# Altium project ctrl_board.PrjPCB
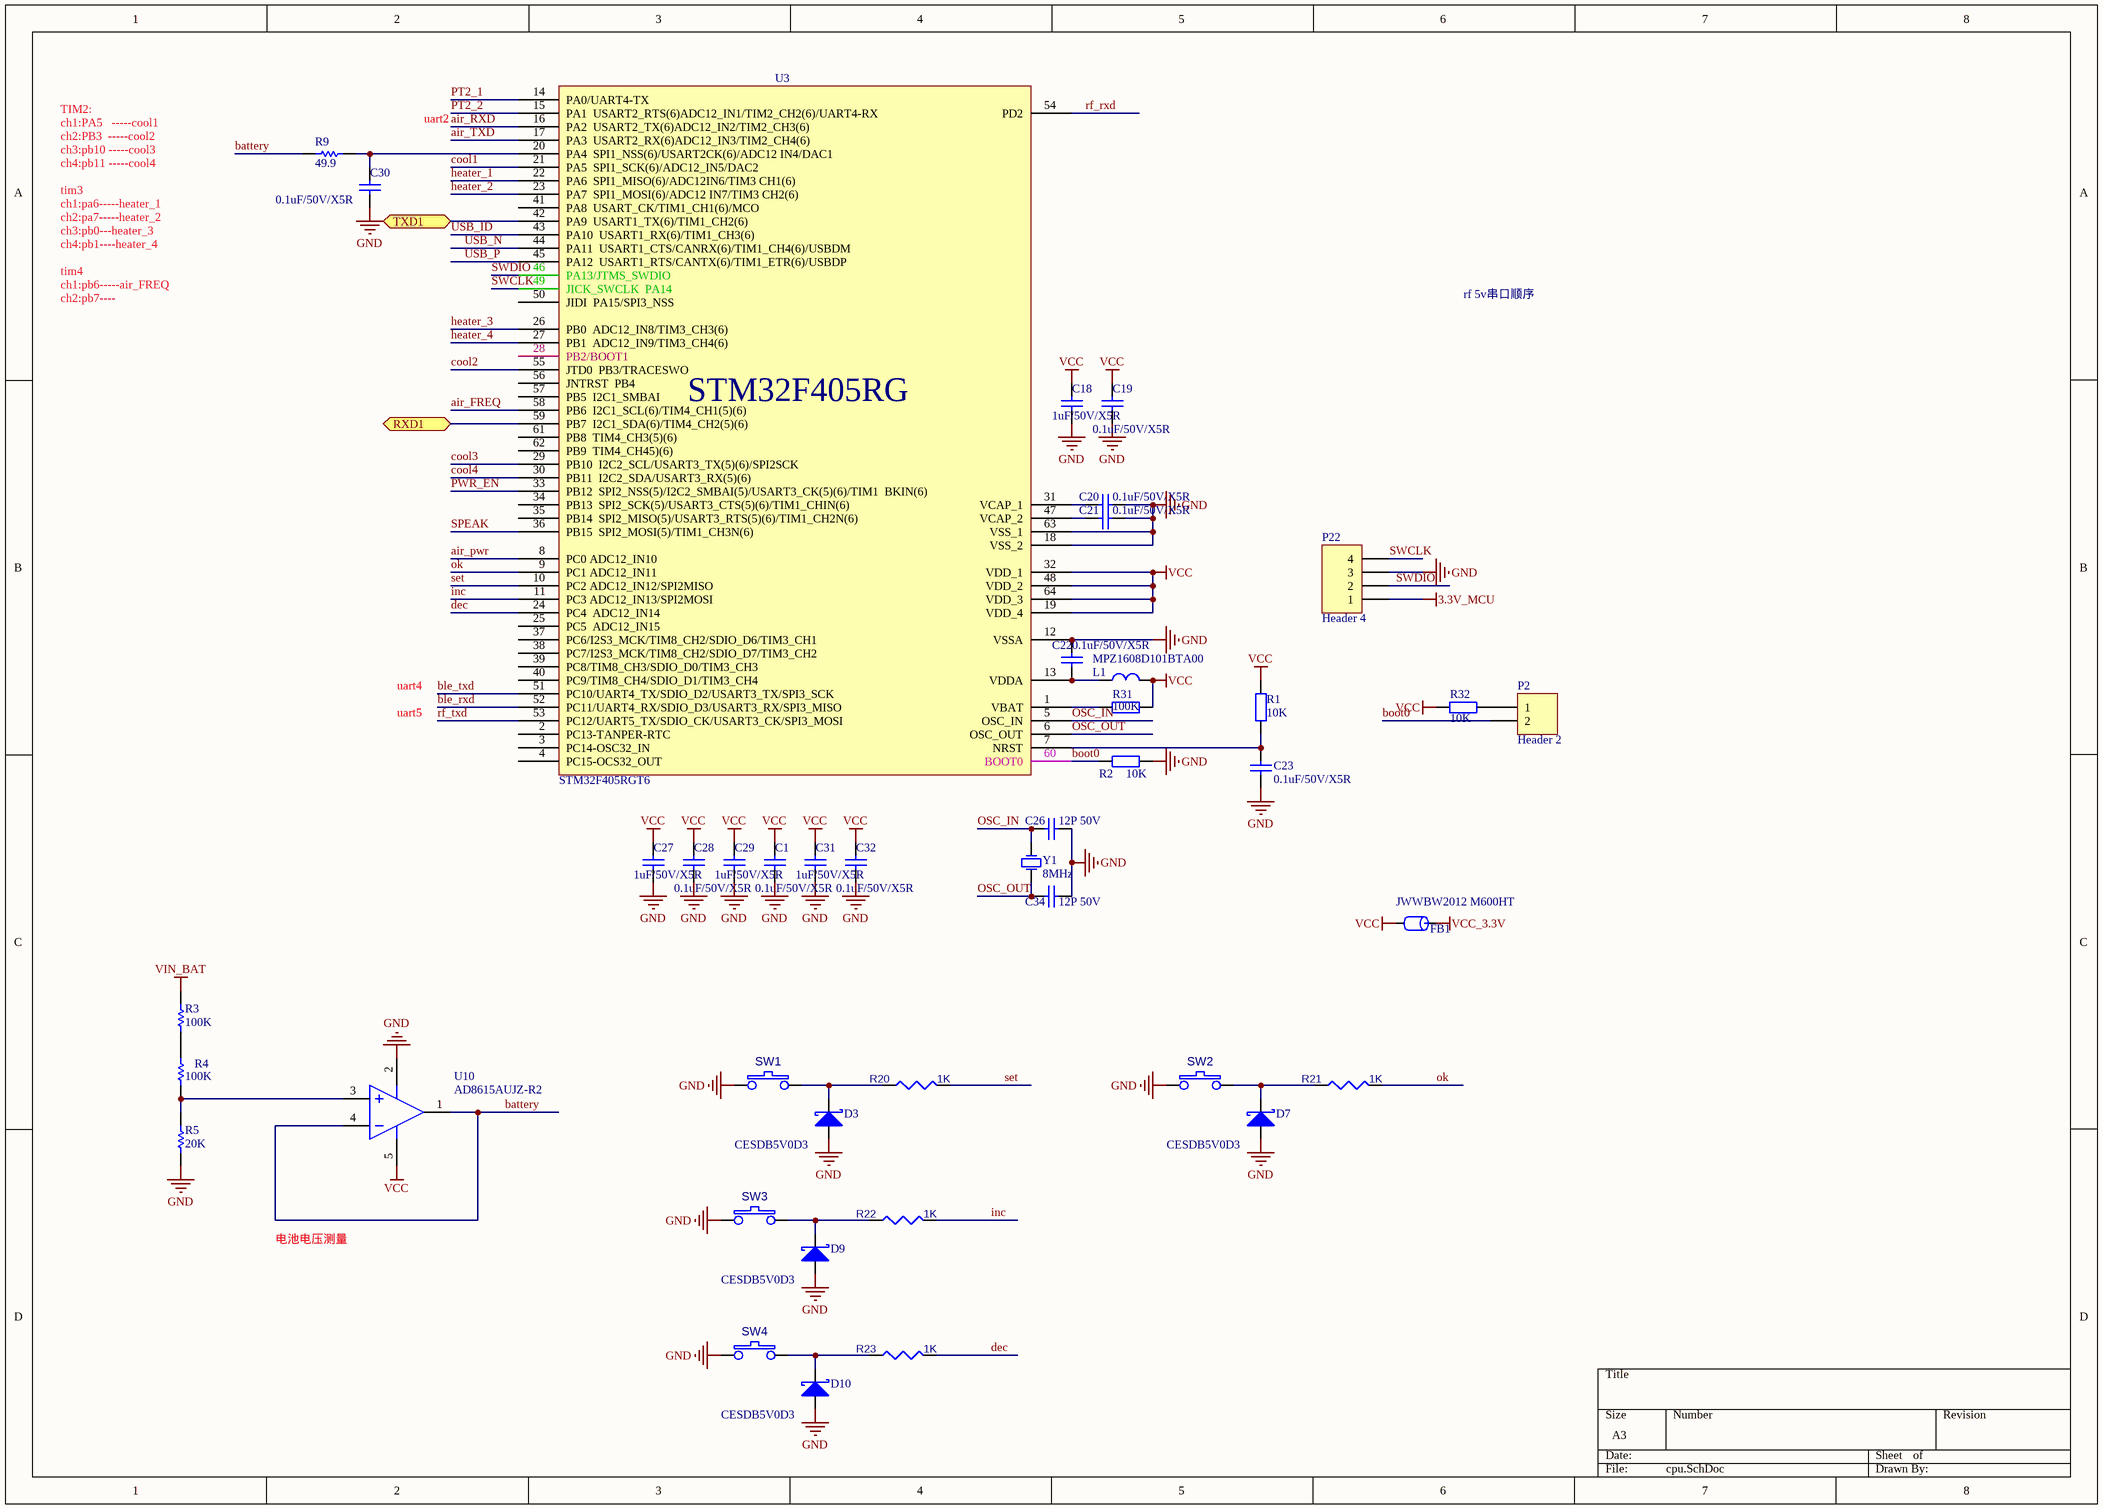
[diagram p0: cpu.SchDoc]
4 sheets, 105 parts. Net scope: global (net labels, ports and power ports of the same name join across sheets).
Board file: ctrl_boardV1.1.PcbDoc
Sheets:
  cpu.SchDoc
  connector.SchDoc
  power.SchDoc
  drv.SchDoc

## Sheet cpu.SchDoc
size A3

### Parts
(Parts that share a designator on the sheet are numbered #1, #2 ... from top to bottom, then left to right.)
C1  0.1uF/50V/X5R  [0603C]
C18  1uF/50V/X5R  [0603C]
C19  0.1uF/50V/X5R  [0603C]
C20  0.1uF/50V/X5R  [0603C]
C21  0.1uF/50V/X5R  [0603C]
C22  0.1uF/50V/X5R  [0603C]
C23  0.1uF/50V/X5R  [0603C]
C26#1  12P 50V  [0603C]
C27#1  1uF/50V/X5R  [0603C]
C28#1  0.1uF/50V/X5R  [0603C]
C29#1  1uF/50V/X5R  [0603C]
C30#1  0.1uF/50V/X5R  [0603C]
C31#1  1uF/50V/X5R  [0603C]
C32#1  0.1uF/50V/X5R  [0603C]
C34  12P 50V  [0603C]
D3  CESDB5V0D3  [SOD323]
D7  CESDB5V0D3  [SOD323]
D9  CESDB5V0D3  [SOD323]
D10  CESDB5V0D3  [SOD323]
FB1  JWWBW2012 M600HT  [0805CZ]
L1  MPZ1608D101BTA00  [0603R]
P2#1  Header 2  [HDR1X2]
P22  Header 4  [HDR1X4]
R1  10K  [0603R]
R2  10K  [0603R]
R3  100K  [0603R]
R4  100K  [0603R]
R5  20K  [0603R]
R9  49.9  [0603R]
R20  value 1K  [0603R]  (hidden comment: 1k/1%)
R21  value 1K  [0603R]  (hidden comment: 1k/1%)
R22  value 1K  [0603R]  (hidden comment: 1k/1%)
R23  value 1K  [0603R]  (hidden comment: 1k/1%)
R31  100K  [0603R]
R32  10K  [0603R]
SW1  SW PUSHBUTTON  [SW-SMD_L3.9-W3.0-P4.45]  (value not drawn)
SW2  SW PUSHBUTTON  [SW-SMD_L3.9-W3.0-P4.45]  (value not drawn)
SW3  SW PUSHBUTTON  [SW-SMD_L3.9-W3.0-P4.45]  (value not drawn)
SW4  SW PUSHBUTTON  [SW-SMD_L3.9-W3.0-P4.45]  (value not drawn)
U3  STM32F405RGT6  [LQFP-64]
U10  AD8615AUJZ-R2  [sot-23-5]
Y1  8MHz  [CRAY_5032]

### Ports
RXD1 (bidir), TXD1 (bidir)

### Nets
3.3V_MCU: P22.1
GND: C1.1 C18.1 C19.1 C20.1 C21.1 C22.1 C23.1 C26#1.1 C27#1.1 C28#1.1 C29#1.1 C30#1.1 C31#1.1 C32#1.1 C34.1 D3.1(A) D7.1(A) D9.1(A) D10.1(A) P22.3 R2.2 R5.2 SW1.1 SW2.1 SW3.1 SW4.1 U3.12(VSSA) U3.18(VSS_2) U3.63(VSS_1) U10.2(G)
VCC: C1.2 C18.2 C19.2 C27#1.2 C28#1.2 C29#1.2 C31#1.2 C32#1.2 FB1.2 L1.2 R1.1 R31.1 R32.2 U3.19(VDD_4) U3.32(VDD_1) U3.48(VDD_2) U3.64(VDD_3) U10.5(VCC)
VCC_3.3V: FB1.1
VIN_BAT: R3.1
air_FREQ: U3.58(PB6__I2C1_SCL(6)/TIM4_CH1(5)(6))
air_pwr: U3.8(PC0_ADC12_IN10)
air_RXD: U3.16(PA2__USART2_TX(6)ADC12_IN2/TIM2_CH3(6))
air_TXD: U3.17(PA3__USART2_RX(6)ADC12_IN3/TIM2_CH4(6))
battery: R9.1 U10.1(OS_NUL) U10.4(V-)
ble_rxd: U3.52(PC11/UART4_RX/SDIO_D3/USART3_RX/SPI3_MISO)
ble_txd: U3.51(PC10/UART4_TX/SDIO_D2/USART3_TX/SPI3_SCK)
boot0: P2#1.2 R2.1 U3.60(BOOT0)
cool1: U3.21(PA5__SPI1_SCK(6)/ADC12_IN5/DAC2)
cool2: U3.55(JTD0__PB3/TRACESWO)
cool3: U3.29(PB10__I2C2_SCL/USART3_TX(5)(6)/SPI2SCK)
cool4: U3.30(PB11__I2C2_SDA/USART3_RX(5)(6))
dec: R23.2 U3.24(PC4__ADC12_IN14)
heater_1: U3.22(PA6__SPI1_MISO(6)/ADC12IN6/TIM3_CH1(6))
heater_2: U3.23(PA7__SPI1_MOSI(6)/ADC12_IN7/TIM3_CH2(6))
heater_3: U3.26(PB0__ADC12_IN8/TIM3_CH3(6))
heater_4: U3.27(PB1__ADC12_IN9/TIM3_CH4(6))
inc: R22.2 U3.11(PC3_ADC12_IN13/SPI2MOSI)
ok: R21.2 U3.9(PC1_ADC12_IN11)
OSC_IN: C26#1.2 U3.5(OSC_IN) Y1.2(OSC2)
OSC_OUT: C34.2 U3.6(OSC_OUT) Y1.1(OSC1)
PT2_1: U3.14(PA0/UART4-TX)
PT2_2: U3.15(PA1__USART2_RTS(6)ADC12_IN1/TIM2_CH2(6)/UART4-RX)
PWR_EN: U3.33(PB12__SPI2_NSS(5)/I2C2_SMBAI(5)/USART3_CK(5)(6)/TIM1__BKIN(6))
rf_rxd: U3.54(PD2)
rf_txd: U3.53(PC12/UART5_TX/SDIO_CK/USART3_CK/SPI3_MOSI)
set: R20.2 U3.10(PC2_ADC12_IN12/SPI2MISO)
SPEAK: U3.36(PB15__SPI2_MOSI(5)/TIM1_CH3N(6))
SWCLK: P22.4 U3.49(JICK_SWCLK__PA14)
SWDIO: P22.2 U3.46(PA13/JTMS_SWDIO)
USB_ID: U3.43(PA10__USART1_RX(6)/TIM1_CH3(6))
USB_N: U3.44(PA11__USART1_CTS/CANRX(6)/TIM1_CH4(6)/USBDM)
USB_P: U3.45(PA12__USART1_RTS/CANTX(6)/TIM1_ETR(6)/USBDP)
NetC20_2: C20.2 U3.31(VCAP_1)
NetC21_2: C21.2 U3.47(VCAP_2)
NetC22_2: C22.2 L1.1 U3.13(VDDA)
NetC23_2: C23.2 R1.2 U3.7(NRST)
NetC30#1_2: C30#1.2 R9.2 U3.20(PA4__SPI1_NSS(6)/USART2CK(6)/ADC12_IN4/DAC1)
NetD3_2: D3.2(K) R20.1 SW1.2
NetD7_2: D7.2(K) R21.1 SW2.2
NetD9_2: D9.2(K) R22.1 SW3.2
NetD10_2: D10.2(K) R23.1 SW4.2
NetP2#1_1: P2#1.1 R32.1
NetR3_2: R3.2 R4.1
NetR4_2: R4.2 R5.1 U10.3(V+)
NetR31_2: R31.2 U3.1(VBAT)
NetR46_2: U3.42(PA9__USART1_TX(6)/TIM1_CH2(6)) ; port TXD1
NetR47_2: U3.59(PB7__I2C1_SDA(6)/TIM4_CH2(5)(6)) ; port RXD1

Not connected (* = marked no-connect by the designer): U3 2(PC13-TANPER-RTC) 3(PC14-OSC32_IN) 4(PC15-OCS32_OUT) 25(PC5__ADC12_IN15) 28(PB2/BOOT1) 34(PB13__SPI2_SCK(5)/USART3_CTS(5)(6)/TIM1_CHIN(6)) 35(PB14__SPI2_MISO(5)/USART3_RTS(5)(6)/TIM1_CH2N(6)) 37(PC6/I2S3_MCK/TIM8_CH2/SDIO_D6/TIM3_CH1) 38(PC7/I2S3_MCK/TIM8_CH2/SDIO_D7/TIM3_CH2) 39(PC8/TIM8_CH3/SDIO_D0/TIM3_CH3) 40(PC9/TIM8_CH4/SDIO_D1/TIM3_CH4) 41(PA8__USART_CK/TIM1_CH1(6)/MCO) 50(JIDI__PA15/SPI3_NSS) 56(JNTRST__PB4) 57(PB5__I2C1_SMBAI) 61(PB8__TIM4_CH3(5)(6)) 62(PB9__TIM4_CH45)(6))

### Notes on the sheet
- uart2
- TIM2:
  ch1:PA5   -----cool1
  ch2:PB3  -----cool2
  ch3:pb10 -----cool3
  ch4:pb11 -----cool4
  tim3
  ch1:pa6-----heater_1
  ch2:pa7-----heater_2
  ch3:pb0---heater_3
  ch4:pb1----heater_4
  tim4
  ch1:pb6-----air_FREQ
  ch2:pb7----
- rf 5v串口顺序
- uart4
- uart5
- 电池电压测量

### Library data of the parts
C1 C18-C23 C26#1 C27#1 C28#1 C29#1 C30#1 C31#1 C32#1 C34 = CAP4: 贴片电容 20%
D3 D7 D9 D10 = DIODE S: Schottky Diode
FB1 = FB: Part Field 1: 磁珠/0603/1K ohm/100MHz; Text Field1: FB; Value: JWWBW2012 M600HT
L1 = CIZHU1: 磁珠电感 100R 100MHz
P2#1 = Header 2: Header, 2-Pin; LatestRevisionDate: 17-Jul-2002; LatestRevisionNote: Re-released for DXP Platform.; Publisher: Altium Limited
P22 = Header 4: Header, 4-Pin; LatestRevisionDate: 17-Jul-2002; LatestRevisionNote: Re-released for DXP Platform.; Publisher: Altium Limited
R1 R2 R31 R32 = RES2: 贴片电阻 5%
R3-R5 R9 = Res1: Resistor; Published: 8-Jun-2000; LatestRevisionDate: 17-Jul-2002; LatestRevisionNote: Re-released for DXP Platform.; PackageReference: AXIAL-0.3; Publisher: Altium Limited
R20-R23 = RESISTOR_0: Part Reference: R70; SIGNAL_MODEL: DEFAULT_RESISTOR_200OHM_1_2; PCB Footprint: R0402
SW1-SW4 = SW PUSHBUTTON: Part Reference: SW2; PCB Footprint: KEY_3X6; Value: SW PUSHBUTTON
U3 = STM32F405RG: MCU
U10 = AD8615
Y1 = XTAL: 晶振

## Sheet connector.SchDoc
size A4
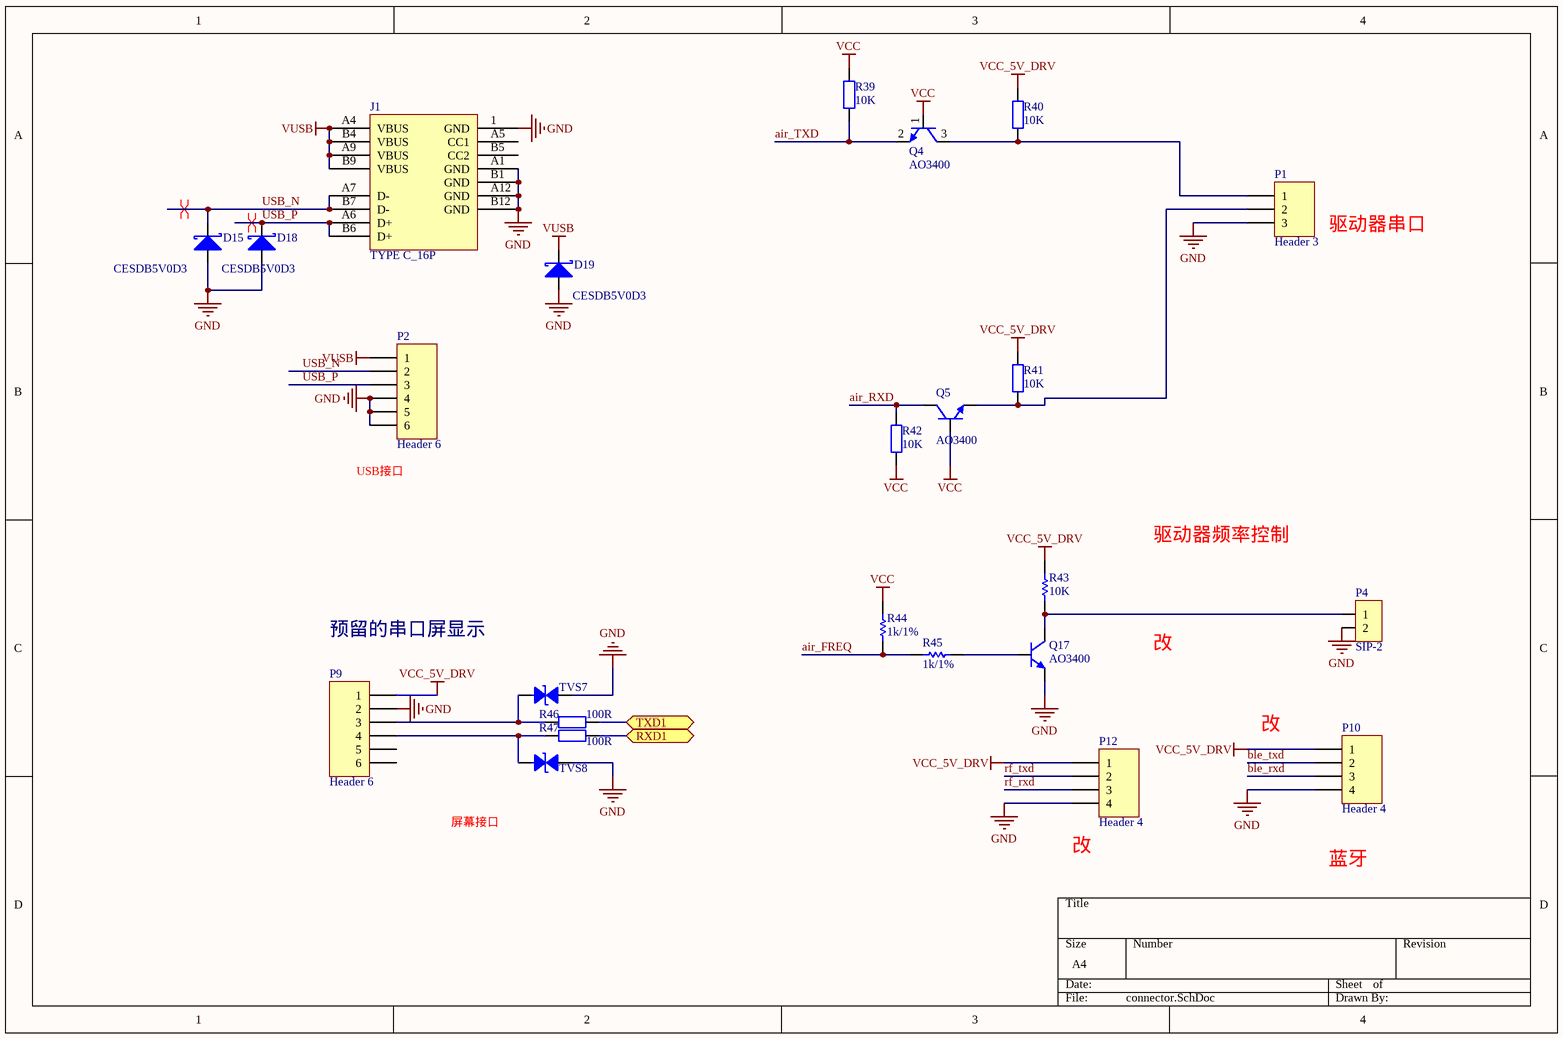
[diagram p1: connector.SchDoc]

### Parts
(Parts that share a designator on the sheet are numbered #1, #2 ... from top to bottom, then left to right.)
D15  CESDB5V0D3  [SOD323]
D18  CESDB5V0D3  [SOD323]
D19  CESDB5V0D3  [SOD323]
J1  TYPE C_16P  [TYPEC_16P]
P1  Header 3  [3X2.54MMZ]
P2#2  Header 6  [USB-A]
P4  SIP-2  [SIP-2A]
P9  Header 6  [6X2MMZ]
P10  Header 4  [4X2.54MMZ]
P12  Header 4  [4X2.54MMZ]
Q4  AO3400  [SOT-23]
Q5  AO3400  [SOT-23]
Q17  AO3400  [SOT23-3]
R39  10K  [0603r]
R40  10K  [0603r]
R41  10K  [0603r]
R42  10K  [0603r]
R43  10K  [0603R]
R44  1k/1%  [0603R]
R45  1k/1%  [0603R]
R46  100R  [0603R]
R47  100R  [0603R]
TVS7  ESD5Z5.0CT1G  [SOD-523]  (value not drawn)
TVS8  ESD5Z5.0CT1G  [SOD-523]  (value not drawn)

### Ports
RXD1 (bidir), TXD1 (bidir)

### Nets
GND: D15.1(A) D18.1(A) D19.1(A) J1.1(GND) J1.A1(GND) J1.A12(GND) J1.B1(GND) J1.B12(GND) P1.3 P2#2.4 P2#2.5 P2#2.6 P4.2 P9.2 P10.4 P12.4 Q17.2(E) TVS7.1(A) TVS8.1(A)
VCC: Q4.1(B) Q5.1(B) R39.2 R42.1 R44.1
VCC_5V_DRV: P9.1 P10.1 P12.1 R40.2 R41.2 R43.2
VUSB: D19.2(K) J1.A4(VBUS) J1.A9(VBUS) J1.B4(VBUS) J1.B9(VBUS) P2#2.1
air_FREQ: R44.2 R45.2
air_RXD: Q5.3(C) R42.2
air_TXD: Q4.2(E) R39.1
ble_rxd: P10.3
ble_txd: P10.2
rf_rxd: P12.3
rf_txd: P12.2
USB_N: D15.2(K) J1.A7(D-) J1.B7(D-) P2#2.2
USB_P: D18.2(K) J1.A6(D+) J1.B6(D+) P2#2.3
NetP1_1: P1.1 Q4.3(C) R40.1
NetP1_2: P1.2 Q5.2(E) R41.1
NetP4_1: P4.1 Q17.3(C) R43.1
NetP9_3: P9.3 R46.1 TVS7.2(B)
NetP9_4: P9.4 R47.1 TVS8.2(B)
NetQ17_1: Q17.1(B) R45.1
NetR46_2: R46.2 ; port TXD1
NetR47_2: R47.2 ; port RXD1

Not connected (* = marked no-connect by the designer): J1 A5(CC1) B5(CC2); P9 5 6

### Layout directives
differential pair: USB_N, USB_P

### Notes on the sheet
- 驱动器串口
- (near P2#2) USB接口
- 驱动器频率控制
- 预留的串口屏显示
- 改
- 屏幕接口
- (near P12) 改
- 蓝牙

### Library data of the parts
D15 D18 D19 = DIODE S: Schottky Diode
P1 = Header 3: Header, 3-Pin; LatestRevisionDate: 17-Jul-2002; LatestRevisionNote: Re-released for DXP Platform.; Publisher: Altium Limited
P2#2 P9 = Header 6: Header, 6-Pin; LatestRevisionDate: 17-Jul-2002; LatestRevisionNote: Re-released for DXP Platform.; Publisher: Altium Limited
P4 = SIP-2: XH2.54 2P 立贴
P10 P12 = Header 4: Header, 4-Pin; LatestRevisionDate: 17-Jul-2002; LatestRevisionNote: Re-released for DXP Platform.; Publisher: Altium Limited
Q4 Q5 Q17 = NPN-1: NPN
R39-R42 = R: 贴片电阻 1%
R43-R45 = Res1: Resistor; Published: 8-Jun-2000; LatestRevisionDate: 17-Jul-2002; LatestRevisionNote: Re-released for DXP Platform.; PackageReference: AXIAL-0.3; Publisher: Altium Limited
R46 R47 = RES2: 贴片电阻 5%
TVS7 TVS8 = TVS-1: TVS

## Sheet power.SchDoc
size A3
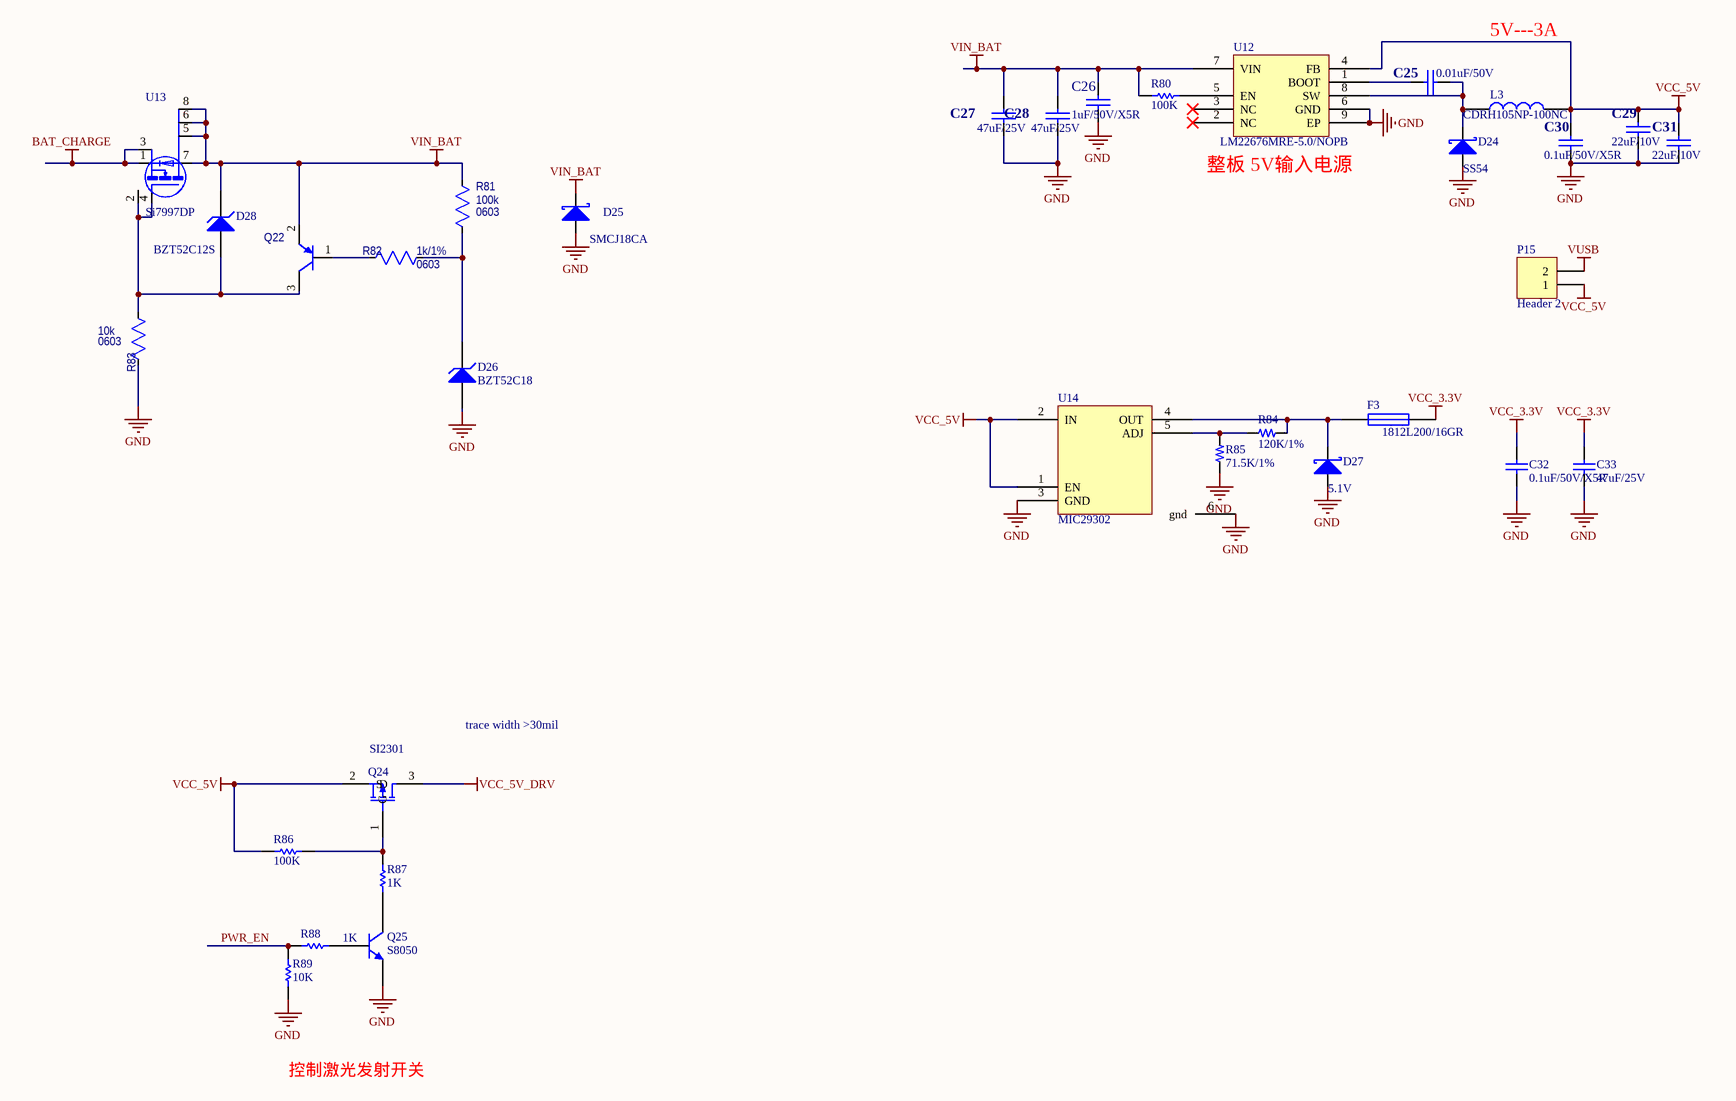
[diagram p2: power.SchDoc]

### Parts
(Parts that share a designator on the sheet are numbered #1, #2 ... from top to bottom, then left to right.)
C25  0.01uF/50V  [0603C]
C26#2  1uF/50V/X5R  [0603C]
C27#2  47uF/25V  [1210C]
C28#2  47uF/25V  [1210C]
C29#2  22uF/10V  [1210C]
C30#2  0.1uF/50V/X5R  [0603C]
C31#2  22uF/10V  [1210C]
C32#2  0.1uF/50V/X5R  [0603C]
C33  47uF/25V  [1206C]
D24  SS54  [SMC]
D25  SMCJ18CA  [SMC]
D26  BZT52C18  [sod123]
D27  5.1V  [SMA]
D28  BZT52C12S  [DIOD-SOD323-2_V]
F3  1812L200/16GR  [1812-F]
L3  CDRH105NP-100NC  [CDRH105]
P15  Header 2  [HDR1X2]
Q22  MMBT4403-7-F  [SOT23-3]  (value not drawn)
Q24  SI2301  [SOT23-3]
Q25  S8050  [SOT23-3]
R80  100K  [0603R]
R81  Package: 0603  [RESC1608X055N_0603]  (hidden comment: 100k)
R82  Package: 0603  [RESC1608X055N_0603]  (hidden comment: 1k/1%)
R83  Package: 0603  [RESC1608X055N_0603]  (hidden comment: 10k)
R84  120K/1%  [0603R]
R85  71.5K/1%  [0603R]
R86  100K  [0603R]
R87  1K  [0603R]
R88  1K  [0603R]
R89  10K  [0603R]
U12  LM22676MRE-5.0/NOPB  [SOP127P600X168_HS-8N]
U13  Si7997DP  [PowerPAK SO-8]
U14  MIC29302  [TO228P1435X457-6N]

### Nets
BAT_CHARGE: U13.1(S) U13.3(S)
GND: C26#2.1 C27#2.2 C28#2.2 C29#2.2 C30#2.2 C31#2.2 C32#2.1 C33.1 D24.1(A) D25.1(A) D26.1(A) D27.1(A) Q25.2(E) R83.2 R85.1 R89.2 U12.6(GND) U12.9(EP) U14.3(GND) U14.6(gnd)
VCC_3.3V: C32#2.2 C33.2 F3.2
VCC_5V: C29#2.1 C30#2.1 C31#2.1 L3.2 P15.1 Q24.2(S) R86.2 U12.4(FB) U14.1(EN) U14.2(IN)
VCC_5V_DRV: Q24.3(D)
VIN_BAT: C26#2.2 C27#2.1 C28#2.1 D25.2(K) D28.2(K) Q22.2(E) R80.2 R81.2 U12.7(VIN) U13.5(D) U13.6(D) U13.7(D) U13.8(D)
VUSB: P15.2
PWR_EN: R88.2 R89.1
NetC25_1: C25.1 D24.2(K) L3.1 U12.8(SW)
NetC25_2: C25.2 U12.1(BOOT)
NetD26_2: D26.2(K) R81.1 R82.1
NetD27_2: D27.2(K) F3.1 R84.1 U14.4(OUT)
NetD28_1: D28.1(A) Q22.3(C) R83.1 U13.2(G) U13.4(G)
NetQ22_1: Q22.1(B) R82.2
NetQ24_1: Q24.1(G) R86.1 R87.2
NetQ25_1: Q25.1(B) R88.1
NetQ25_3: Q25.3(C) R87.1
NetR80_1: R80.1 U12.5(EN)
NetR84_2: R84.2 R85.2 U14.5(ADJ)

Not connected (* = marked no-connect by the designer): U12 2(NC)* 3(NC)*

### Notes on the sheet
- 5V---3A
- (near U12) 整板 5V输入电源
- trace width >30mil
- 控制激光发射开关

### Library data of the parts
C25 C26#2 C27#2 C28#2 C29#2 C30#2 C31#2 = CAP: Capacitor
C32#2 C33 = Cap: Capacitor; Value: 22nF; Published: 8-Jun-2000; LatestRevisionDate: 17-Jul-2002; LatestRevisionNote: Re-released for DXP Platform.; PackageReference: RAD-0.3; Publisher: Altium Limited; PackageDescription: Radial Cap, Thru-Hole; 2 Leads; 0.3 in Pin Spacing
D24 D25 D27 = DIODE S: Schottky Diode
D26 = BZT52C12S-7-F: Zener Current: 5mA; Vz - Zener Voltage: 12V; Pd - Power Dissipation: 200mW; Zz - Zener Impedance: 40Ohms; Unit Weight: 0.000173oz; Voltage Temperature Coefficient: 0.25mV/C; Voltage Tolerance: 5%; Package Reference: SOD323-2; Minimum Operating Temperature: -65C; Packaging: Reel; Product Category: ZenerDiodes; Termination Style: SMD/SMT; Mounting Style: SMD/SMT; RoHS: True; Package / Case: SOD-323; Package Description: 2-Pin Surface Mount Device, Body 1.7 x 1.3 mm; Width: 1.4mm; Mounting Technology: SurfaceMount; Package URL: http://www.vishay.com/docs/71192/71192.pdf; Series: BZT52C12; Value: BZT52C12S-7-F
D28 = BZT52C12S-7-F: Surface Mount Zener Diode, 12 V, -65 to 150 degC, 2-Pin SOD323, RoHS, Tape and Reel; Manufacturer: DiodesIncorporated; Zener Current: 5mA; Vz - Zener Voltage: 12V; Zz - Zener Impedance: 40Ohms; Voltage Temperature Coefficient: 0.25mV/C; Voltage Tolerance: 5%; Width: 1.4mm; Value: BZT52C12S
F3 = Fuse 1: Fuse; Published: 8-Jun-2000; LatestRevisionDate: 17-Jul-2002; LatestRevisionNote: Re-released for DXP Platform.; PackageReference: PIN-W2/E2.8; Publisher: Altium Limited; PackageDescription: Thru-Hole; 2 Leads
L3 = INDUCTOR
P15 = Header 2: Header, 2-Pin; LatestRevisionDate: 17-Jul-2002; LatestRevisionNote: Re-released for DXP Platform.; Publisher: Altium Limited
Q22 = OEM_Diodes_MMBT4403: Supplier 1: *; Supplier Part Number 1: *; Value: MMBT4403-7-F
Q24 = MOSFET-P: P-Channel MOSFET; Published: 8-Jun-2000; LatestRevisionDate: 17-Jul-2002; LatestRevisionNote: Re-released for DXP Platform.; PackageVersion: 1995/1996; PackageReference: E3; Publisher: Altium Limited
Q25 = NPN: NPN Bipolar Transistor; Published: 8-Jun-2000; LatestRevisionDate: 17-Jul-2002; LatestRevisionNote: Re-released for DXP Platform.; PackageReference: TO-226; Publisher: Altium Limited; Code_JEDEC: TO-226-AA
R80 R86-R89 = Res1: Resistor; Published: 8-Jun-2000; LatestRevisionDate: 17-Jul-2002; LatestRevisionNote: Re-released for DXP Platform.; PackageReference: AXIAL-0.3; Publisher: Altium Limited
R81 = Resistor_0603: PartNumber: RC0603FR-0716K9L; Power Rating: [power]; TempCo: [tempco]; Tolerance: tol; Value: 100k; SupplierDescription: RES SMD 16.9K OHM 1% 1/10W 0603
R82 R83 = Resistor_0603: PartNumber: RC0603FR-071KL; Power Rating: [power]; TempCo: [tempco]; Tolerance: tol; SupplierDescription: RES SMD 1K OHM 1% 1/10W 0603
  R82: Value: 1k/1%
  R83: Value: 10k
R84 R85 = R
U12 = LM22676MR-5.0
U13 = Si7997DP: Sia430DJ

## Sheet drv.SchDoc
size A4
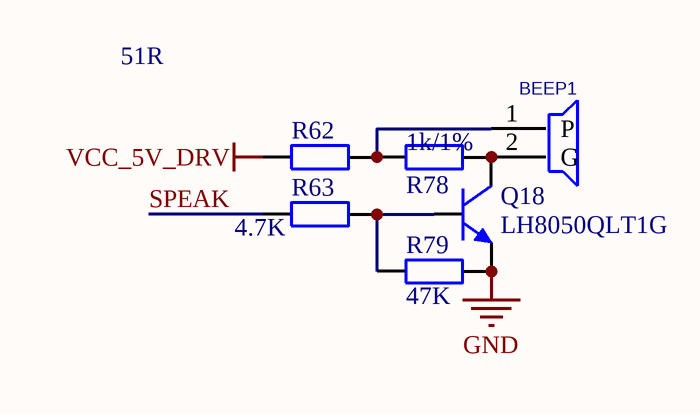
[diagram p3: drv.SchDoc]

### Parts
BEEP1  BEEP-9.5X5.5  [BEEP-9.5X5.5]  (value not drawn)  (no BOM)
Q18  LH8050QLT1G  [SOT-23]
R62  51R  [0603R]
R63  4.7K  [0603R]
R78  1k/1%  [0603R]
R79  47K  [0603R]

### Nets
GND: Q18.2(E) R79.2
VCC_5V_DRV: R62.2
SPEAK: R63.1
NetBEEP1_1: BEEP1.1(P) R62.1 R78.2
NetBEEP1_2: BEEP1.2(G) Q18.3(C) R78.1
NetQ18_1: Q18.1(B) R63.2 R79.1

### Library data of the parts
Q18 = NPN-1: NPN
R62 R63 R78 R79 = RES0: 贴片电阻 5%
BEEP1 = BEEP-9.5X5.5: PCB DECAL: BEEP-9.5X5.5

## Nets that join several sheets
GND: cpu (30 pins), connector (19 pins), power (20 pins), drv (Q18.2 R79.2)
VCC: cpu (18 pins), connector (5 pins)
VCC_3.3V: cpu (FB1.1), power (C32#2.2 C33.2 F3.2)
VCC_5V_DRV: connector (6 pins), power (Q24.3), drv (R62.2)
VIN_BAT: cpu (R3.1), power (13 pins)
VUSB: connector (6 pins), power (P15.2)
air_FREQ: cpu (U3.58), connector (R44.2 R45.2)
air_RXD: cpu (U3.16), connector (Q5.3 R42.2)
air_TXD: cpu (U3.17), connector (Q4.2 R39.1)
ble_rxd: cpu (U3.52), connector (P10.3)
ble_txd: cpu (U3.51), connector (P10.2)
NetR46_2: cpu (U3.42), connector (R46.2)
NetR47_2: cpu (U3.59), connector (R47.2)
PWR_EN: cpu (U3.33), power (R88.2 R89.1)
rf_rxd: cpu (U3.54), connector (P12.3)
rf_txd: cpu (U3.53), connector (P12.2)
SPEAK: cpu (U3.36), drv (R63.1)
USB_N: cpu (U3.44), connector (D15.2 J1.A7 J1.B7 P2#2.2)
USB_P: cpu (U3.45), connector (D18.2 J1.A6 J1.B6 P2#2.3)